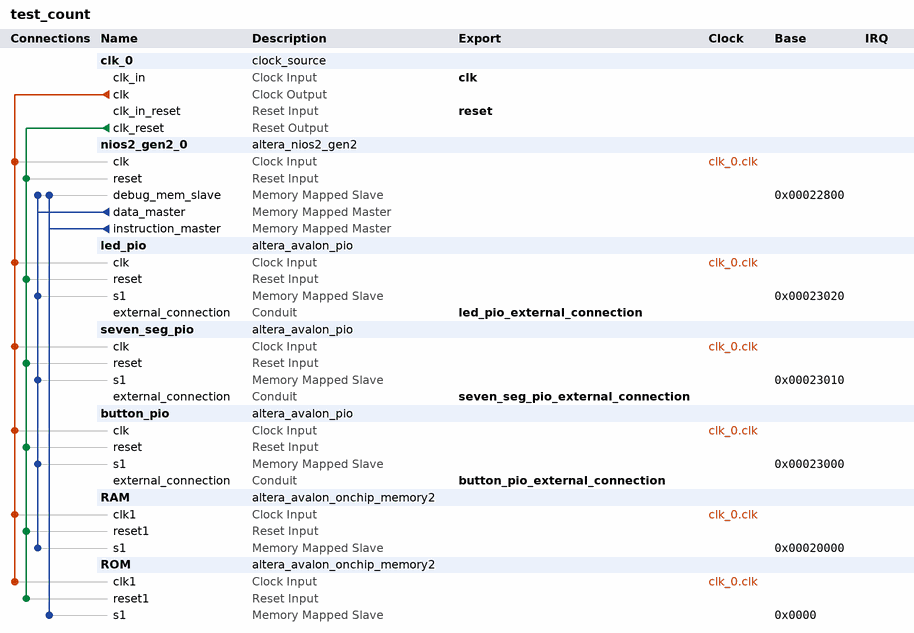
[diagram p0: system contents]
# Platform Designer (Qsys) system test_count, Cyclone V 5CSEMA6F31C6
# Parameters at their usual value, and those the tool derives, are not listed.
package require -exact qsys 20.1
create_system test_count
set_project_property DEVICE_FAMILY {Cyclone V}
set_project_property DEVICE 5CSEMA6F31C6

add_instance clk_0 clock_source 20.1
set_instance_parameter_value clk_0 clockFrequency 50000000

add_instance nios2_gen2_0 altera_nios2_gen2 20.1
set_instance_parameter_value nios2_gen2_0 dcache_size 2048
set_instance_parameter_value nios2_gen2_0 exceptionSlave ROM.s1
set_instance_parameter_value nios2_gen2_0 icache_size 4096
set_instance_parameter_value nios2_gen2_0 impl Tiny
set_instance_parameter_value nios2_gen2_0 resetSlave ROM.s1

add_instance led_pio altera_avalon_pio 20.1
set_instance_parameter_value led_pio direction Output
set_instance_parameter_value led_pio width 8

add_instance seven_seg_pio altera_avalon_pio 20.1
set_instance_parameter_value seven_seg_pio direction Output
set_instance_parameter_value seven_seg_pio width 7

add_instance button_pio altera_avalon_pio 20.1
set_instance_parameter_value button_pio direction Input
set_instance_parameter_value button_pio width 4

add_instance RAM altera_avalon_onchip_memory2 20.1
set_instance_parameter_value RAM dataWidth 32
set_instance_parameter_value RAM dualPort false
set_instance_parameter_value RAM initMemContent true
set_instance_parameter_value RAM initializationFileName onchip_mem.hex
set_instance_parameter_value RAM memorySize 6096

add_instance ROM altera_avalon_onchip_memory2 20.1
set_instance_parameter_value ROM dataWidth 32
set_instance_parameter_value ROM dualPort false
set_instance_parameter_value ROM initMemContent true
set_instance_parameter_value ROM initializationFileName onchip_mem.hex
set_instance_parameter_value ROM memorySize 66000
set_instance_parameter_value ROM writable false

# connections
add_connection clk_0.clk button_pio.clk clock
add_connection clk_0.clk led_pio.clk clock
add_connection clk_0.clk nios2_gen2_0.clk clock
add_connection clk_0.clk RAM.clk1 clock
add_connection clk_0.clk ROM.clk1 clock
add_connection clk_0.clk seven_seg_pio.clk clock
add_connection clk_0.clk_reset button_pio.reset reset
add_connection clk_0.clk_reset led_pio.reset reset
add_connection clk_0.clk_reset nios2_gen2_0.reset reset
add_connection clk_0.clk_reset RAM.reset1 reset
add_connection clk_0.clk_reset ROM.reset1 reset
add_connection clk_0.clk_reset seven_seg_pio.reset reset
add_connection nios2_gen2_0.data_master button_pio.s1 avalon
set_connection_parameter_value nios2_gen2_0.data_master/button_pio.s1 baseAddress 0x00023000
add_connection nios2_gen2_0.data_master led_pio.s1 avalon
set_connection_parameter_value nios2_gen2_0.data_master/led_pio.s1 baseAddress 0x00023020
add_connection nios2_gen2_0.data_master nios2_gen2_0.debug_mem_slave avalon
set_connection_parameter_value nios2_gen2_0.data_master/nios2_gen2_0.debug_mem_slave baseAddress 0x00022800
add_connection nios2_gen2_0.data_master RAM.s1 avalon
set_connection_parameter_value nios2_gen2_0.data_master/RAM.s1 baseAddress 0x00020000
add_connection nios2_gen2_0.data_master seven_seg_pio.s1 avalon
set_connection_parameter_value nios2_gen2_0.data_master/seven_seg_pio.s1 baseAddress 0x00023010
add_connection nios2_gen2_0.instruction_master nios2_gen2_0.debug_mem_slave avalon
set_connection_parameter_value nios2_gen2_0.instruction_master/nios2_gen2_0.debug_mem_slave baseAddress 0x00022800
add_connection nios2_gen2_0.instruction_master ROM.s1 avalon
set_connection_parameter_value nios2_gen2_0.instruction_master/ROM.s1 baseAddress 0x0000

# exported interfaces
add_interface button_pio_external_connection conduit end
set_interface_property button_pio_external_connection EXPORT_OF button_pio.external_connection
add_interface clk clock sink
set_interface_property clk EXPORT_OF clk_0.clk_in
add_interface led_pio_external_connection conduit end
set_interface_property led_pio_external_connection EXPORT_OF led_pio.external_connection
add_interface reset reset sink
set_interface_property reset EXPORT_OF clk_0.clk_in_reset
add_interface seven_seg_pio_external_connection conduit end
set_interface_property seven_seg_pio_external_connection EXPORT_OF seven_seg_pio.external_connection

set_interconnect_requirement {$system} qsys_mm.clockCrossingAdapter HANDSHAKE
set_interconnect_requirement {$system} qsys_mm.enableEccProtection FALSE
set_interconnect_requirement {$system} qsys_mm.insertDefaultSlave FALSE
set_interconnect_requirement {$system} qsys_mm.maxAdditionalLatency 1

save_system test_count.qsys
